# Altium schematic sheet GSM.SchDoc
size A; SheetNumber: 10; SheetTotal: 12
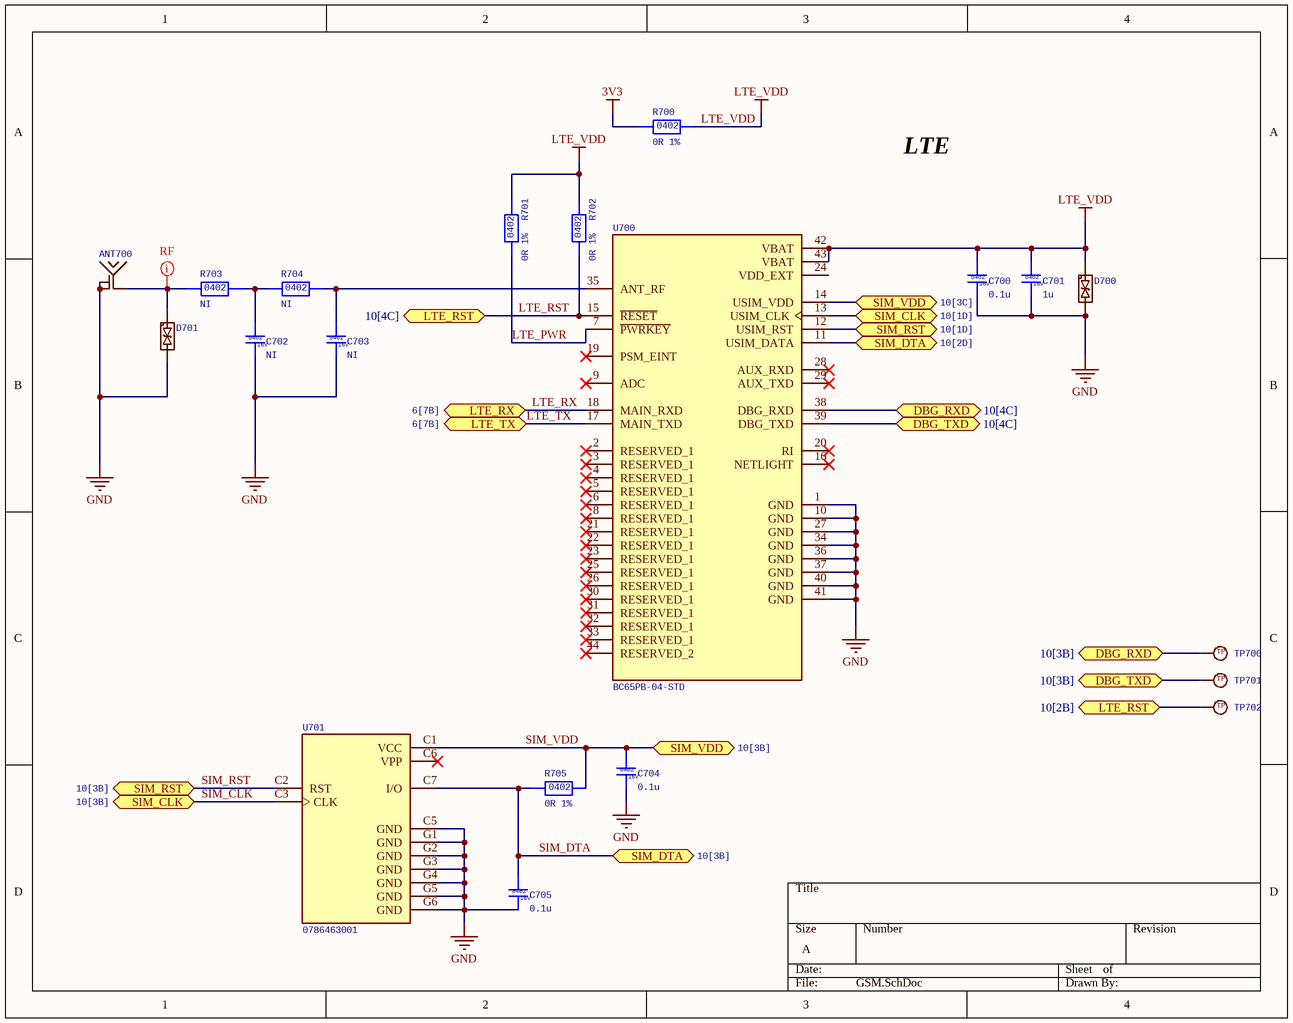
[diagram p0: GSM.SchDoc]

## Parts
ANT700  2337019-1  [2337019-1]  (value not drawn)
C700  0.1u  [CAP0402]
C701  1u  [CAP0402]
C702  NI  [CAP0402]
C703  NI  [CAP0402]
C704  0.1u  [CAP0402]
C705  0.1u  [CAP0402]
D700  DESD3V3S1BL-7B  [DESD3V3S1BL-7B]  (value not drawn)
D701  DESD3V3S1BL-7B  [DESD3V3S1BL-7B]  (value not drawn)
R700  0R 1%  [RES0402]
R701  0R 1%  [RES0402]
R702  0R 1%  [RES0402]
R703  NI  [RES0402]
R704  NI  [RES0402]
R705  0R 1%  [RES0402]
TP700  TP  [TP]  (value not drawn)
TP701  TP  [TP]  (value not drawn)
TP702  TP  [TP]  (value not drawn)
U700  BC65PB-04-STD  [BC65PB-04-STD]
U701  0786463001  [0786463001]

## Ports
DBG_RXD (bidir, see 10[3B]), DBG_RXD (bidir, see 10[4C]), DBG_TXD (bidir, see 10[3B]), DBG_TXD (bidir, see 10[4C]), LTE_RST (bidir, see 10[2B]), LTE_RST (bidir, see 10[4C]), LTE_RX (bidir, see 6[7B]), LTE_TX (bidir, see 6[7B]), SIM_CLK (bidir, see 10[1D]), SIM_CLK (bidir, see 10[3B]), SIM_DTA (bidir, see 10[2D]), SIM_DTA (bidir, see 10[3B]), SIM_RST (bidir, see 10[1D]), SIM_RST (bidir, see 10[3B]), SIM_VDD (bidir, see 10[3B]), SIM_VDD (bidir, see 10[3C])

## Nets
3V3: R700.1
GND: ANT700.G1(GND) ANT700.G2(GND) C700.2 C701.2 C702.2 C703.2 C704.2 C705.2 D700.2 D701.2 U700.1(GND) U700.10(GND) U700.27(GND) U700.34(GND) U700.36(GND) U700.37(GND) U700.40(GND) U700.41(GND) U701.C5(GND) U701.G1(GND) U701.G2(GND) U701.G3(GND) U701.G4(GND) U701.G5(GND) U701.G6(GND)
LTE_VDD: C700.1 C701.1 D700.1 R700.2 R701.2 R702.2 U700.42(VBAT) U700.43(VBAT)
DBG_RXD: TP700.1 U700.38(DBG_RXD) ; port DBG_RXD
DBG_TXD: TP701.1 U700.39(DBG_TXD) ; port DBG_TXD
LTE_PWR: R701.1 U700.7(~{PWRKEY})
LTE_RST: R702.1 TP702.1 U700.15(~{RESET}) ; port LTE_RST
LTE_RX: U700.18(MAIN_RXD) ; port LTE_RX
LTE_TX: U700.17(MAIN_TXD) ; port LTE_TX
SIM_CLK: U700.13(USIM_CLK) U701.C3(CLK) ; port SIM_CLK
SIM_DTA: C705.1 R705.1 U700.11(USIM_DATA) U701.C7(I/O) ; port SIM_DTA
SIM_RST: U700.12(USIM_RST) U701.C2(RST) ; port SIM_RST
SIM_VDD: C704.1 R705.2 U700.14(USIM_VDD) U701.C1(VCC) ; port SIM_VDD
NetANT700_1: ANT700.1 D701.1 R703.1
NetC702_1: C702.1 R703.2 R704.1
NetC703_1: C703.1 R704.2 U700.35(ANT_RF)

Not connected (* = marked no-connect by the designer): U700 2(RESERVED_1)* 3(RESERVED_1)* 4(RESERVED_1)* 5(RESERVED_1)* 6(RESERVED_1)* 8(RESERVED_1)* 9(ADC)* 16(NETLIGHT)* 19(PSM_EINT)* 20(RI)* 21(RESERVED_1)* 22(RESERVED_1)* 23(RESERVED_1)* 24(VDD_EXT) 25(RESERVED_1)* 26(RESERVED_1)* 28(AUX_RXD)* 29(AUX_TXD)* 30(RESERVED_1)* 31(RESERVED_1)* 32(RESERVED_1)* 33(RESERVED_1)* 44(RESERVED_2)*; U701 C6(VPP)*

## Layout directives
mark named RF: NetANT700_1

## Notes on the sheet
- LTE

## Library data of the parts
ANT700 = 2337019-1: UMCC MICRO-COAX RECEPTACLE, GEN; Supplier 1: Digikey; Supplier Part Number 1: A144746CT-ND
C700 C702-C705 = C_0402_0.1u: Ceramic Capacitor, Multilayer, Ceramic, 16V, 10% +Tol, 10% -Tol, X7R, 15% TC, 0.1uF, Surface Mount, 0402; Manufacturer: Murata; Manufacturer Part Number: GRM155R71C104KA88J; Value: 100nF; Multilayer: Yes; Supplier: Digikey; Supplier Part Number: 490-6328-1-ND; RoHS: Yes; Category: Ceramic Capacitors; Stock: 19409569; Pricing: 1=0.1, 10=0.019, 50=0.011, 100=0.0086, 500=0.00646, 1000=0.00508, 2500=0.00462, 5000=0.00425 (USD); Mounting Technology: Surface Mount; Pins: 2; Dielectric Material: Ceramic; Package Shape: Rectangular; Case/Package: 0402; Terminal Finish: Nickel; Min Operating Temperature: -55°C; Max Operating Temperature: 125°C; JESD-609 Code: e3; Capacitor Type: Ceramic; Tolerance  (fill in as +-): 10%; Package Style: SMTMeter; Packaging: Tape and Reel; Tolerance (fill in as +-): 10%; Rated DC Voltage (URdc): 16V; Temperature Characteristics Code: X7R; Termination: Wraparound; Length: 1mm; Width: 0.5mm; Height: 0.5mm; Reach SVHC Compliant: Yes; RoHS Compliant: Yes; ComponentLink1URL: https://psearch.en.murata.com:443/capacitor/product/GRM155R71C104KA88%23.pdf?src-supplier=IHS+Markit; ComponentLink1Description: https://psearch.en.murata.com:443/capacitor/product/GRM155R71C104KA88%23.pdf?src-supplier=IHS+Markit; ComponentLink2URL: https://datasheet.ciiva.com/6271/product-6271168.pdf?src-supplier=Digikey; ComponentLink2Description: https://datasheet.ciiva.com/6271/product-6271168.pdf?src-supplier=Digikey; ComponentLink3URL: https://datasheet.ciiva.com/6271/grm155r71c104ka88-01-6271231.pdf?src-supplier=Digikey; ComponentLink3Description: https://datasheet.ciiva.com/6271/grm155r71c104ka88-01-6271231.pdf?src-supplier=Digikey
C701 = C_0402_1u: Ceramic Capacitor, Multilayer, Ceramic, 16V, 10% +Tol, 10% -Tol, X5R, 15% TC, 1uF, Surface Mount, 0402; Manufacturer: Taiyo Yuden; Manufacturer Part Number: EMK105BJ105KV-F; Multilayer: Yes; Supplier: Digikey; Supplier Part Number: 587-2477-1-ND; RoHS: Yes; Category: Ceramic Capacitors; Stock: 2709915; Pricing: 1=0.1, 10=0.045, 50=0.031, 100=0.0266, 500=0.01912, 1000=0.01682, 2500=0.01437, 5000=0.01289 (USD); Mounting Technology: Surface Mount; Pins: 2; Dielectric Material: Ceramic; Package Shape: Rectangular; Case/Package: 0402; Terminal Finish: Nickel; Min Operating Temperature: -55°C; Max Operating Temperature: 85°C; JESD-609 Code: e3; Value: 1uF; Capacitor Type: Ceramic; Tolerance  (fill in as +-): 10%; Package Style: SMTMeter; Packaging: Tape and Reel; Tolerance (fill in as +-): 10%; Rated DC Voltage (URdc): 16V; Temperature Characteristics Code: X5R; Termination: Wraparound; Length: 1mm; Width: 0.5mm; Height: 0.5mm; Reach SVHC Compliant: Yes; RoHS Compliant: Yes; ComponentLink1URL: https://datasheet.ciiva.com:443/pdfs/VipMasterIC/IC/TAIY/TAIY-S-A0009096450/TAIY-S-A0009096597-1.pdf?src-supplier=IHS+Markit; ComponentLink1Description: https://datasheet.ciiva.com:443/pdfs/VipMasterIC/IC/TAIY/TAIY-S-A0009096450/TAIY-S-A0009096597-1.pdf?src-supplier=IHS+Markit; ComponentLink2URL: https://datasheet.ciiva.com/134/emk105bj105kv-f-ss-134209.pdf?src-supplier=Digikey; ComponentLink2Description: https://datasheet.ciiva.com/134/emk105bj105kv-f-ss-134209.pdf?src-supplier=Digikey; ComponentLink3URL: https://datasheet.ciiva.com/15920/964emk105bj105kv-f-15920402.pdf?src-supplier=Onlinecomponents.com; ComponentLink3Description: https://datasheet.ciiva.com/15920/964emk105bj105kv-f-15920402.pdf?src-supplier=Onlinecomponents.com; ComponentLink4URL: https://datasheet.ciiva.com/26871/getdatasheetpartid-638287-26871289.pdf?src-supplier=Verical; ComponentLink4Description: https://datasheet.ciiva.com/26871/getdatasheetpartid-638287-26871289.pdf?src-supplier=Verical; ComponentLink5URL: https://datasheet.ciiva.com/30259/265emk105bj105kv-f-30259872.pdf?src-supplier=Onlinecomponents.com; ComponentLink5Description: https://datasheet.ciiva.com/30259/265emk105bj105kv-f-30259872.pdf?src-supplier=Onlinecomponents.com; ComponentLink6URL: https://datasheet.ciiva.com/7657/1497285-7657320.pdf?src-supplier=Element14; ComponentLink6Description: https://datasheet.ciiva.com/7657/1497285-7657320.pdf?src-supplier=Element14; ComponentLink7URL: https://datasheet.ciiva.com/22694/1497285-22694239.pdf?src-supplier=Element14; ComponentLink7Description: https://datasheet.ciiva.com/22694/1497285-22694239.pdf?src-supplier=Element14; ComponentLink8URL: https://datasheet.ciiva.com/5424/mlcc01-e-5424190.pdf?src-supplier=Mouser; ComponentLink8Description: https://datasheet.ciiva.com/5424/mlcc01-e-5424190.pdf?src-supplier=Mouser
D700 D701 = DESD3V3S1BL-7B: Trans Voltage Suppressor Diode, 35W, 3.3V V(RWM), Bidirectional, 1 Element, Silicon; Manufacturer: Diodes; Package Body Material: Plastic; Max Breakdown Voltage: 6.5V; Min Breakdown Voltage: 3.8V; Number of Elements: 1; Max Power Dissipation: 250mW; Supplier 1: Digikey; Supplier Part Number 1: DESD3V3S1BL-7BDICT-ND; Supplier: Digikey; Supplier Part Number: DESD3V3S1BL-7BDICT-ND; Manufacturer Part Number: DESD3V3S1BL-7B; RoHS: Yes; Category: TVS Diodes; Stock: 1369752; Pricing: 1=0.22, 10=0.148, 100=0.0722, 500=0.0602, 1000=0.04182, 2000=0.03625, 5000=0.03362, 10000=0.0302, 20000=0.02888 (USD); Pins: 2; Diode Element Material: SILICON; Package Shape: Rectangular; Terminal Finish: Nickel; Min Operating Temperature: -65°C; Max Operating Temperature: 150°C; JESD-609 Code: e4; Polarity: Bidirectional; Diode Type: TRANS VOLTAGE SUPPRESSOR; Moisture Sensitivity Level: 1; Non-rep Peak Rev Power Dis-Max: 35W; Package Style: CHIP CARRIERMeter; Rep Pk Reverse Voltage-Max: 3.3V; Surface Mount: Yes; Technology: AVALANCHE; Terminal Form: No Lead; Terminal Position: BOTTOM; Reach SVHC Compliant: Yes; RoHS Compliant: Yes; ComponentLink1URL: https://datasheet.ciiva.com:443/pdfs/VipMasterIC/IC/DIOD/DIOD-S-A0005045876/DIOD-S-A0005045876-1.pdf?src-supplier=IHS+Markit; ComponentLink1Description: https://datasheet.ciiva.com:443/pdfs/VipMasterIC/IC/DIOD/DIOD-S-A0005045876/DIOD-S-A0005045876-1.pdf?src-supplier=IHS+Markit; ComponentLink2URL: https://datasheet.ciiva.com/48480/desd3v3s1bl-48480026.pdf?src-supplier=Avnet; ComponentLink2Description: https://datasheet.ciiva.com/48480/desd3v3s1bl-48480026.pdf?src-supplier=Avnet
R700-R702 R705 = R_0402_0R: Metal Glaze/thick Film, 0.0625W, 0ohm, Surface Mount, 0402; Manufacturer: Yageo; Manufacturer Part Number: RC0402JR-070RL; Power: 62.5mW; Rated Temperature: 70°C; Package Height: 0.35mm; Package Length: 1mm; Package Width: 0.5mm; Supplier 1: Digikey; Supplier Part Number 1: 311-0.0JRTR-ND; Supplier: Digikey; Supplier Part Number: 311-0.0JRCT-ND; RoHS: Yes; Category: Chip SMD Resistors; Stock: 14877447; Pricing: 1=0.1, 10=0.011, 25=0.0084, 50=0.0064, 100=0.0045, 250=0.00364, 500=0.0029, 1000=0.00214, 5000=0.00154, 10000=0.00133, 30000=0.00117, 50000=0.00107, 100000=0.00105 (USD); Mounting Technology: Surface Mount; Pins: 2; Package Shape: Rectangular; Case/Package: 0402; Terminal Finish: Nickel; Min Operating Temperature: -55°C; Max Operating Temperature: 155°C; JESD-609 Code: e3; Resistor Type: FIXED RESISTOR; Packaging: Tape and Reel; Value: 0R; Technology: METAL GLAZE/THICK FILM; Termination: Wraparound; Construction: Chip; Package Style: SMTMeter; Reach SVHC Compliant: Yes; RoHS Compliant: Yes; ComponentLink1URL: https://datasheet.ciiva.com:443/pdfs/VipMasterIC/IC/YAGO/YAGO-S-A0008145938/YAGO-S-A0008145938-1.pdf?src-supplier=IHS+Markit; ComponentLink1Description: https://datasheet.ciiva.com:443/pdfs/VipMasterIC/IC/YAGO/YAGO-S-A0008145938/YAGO-S-A0008145938-1.pdf?src-supplier=IHS+Markit; ComponentLink2URL: https://datasheet.ciiva.com/2452/pyu-rc0402-51-rohs-l-6-2452608.pdf?src-supplier=Digikey; ComponentLink2Description: https://datasheet.ciiva.com/2452/pyu-rc0402-51-rohs-l-6-2452608.pdf?src-supplier=Digikey; ComponentLink3URL: https://datasheet.ciiva.com/11808/0900766b80c66297-11808195.pdf?src-supplier=Rs; ComponentLink3Description: https://datasheet.ciiva.com/11808/0900766b80c66297-11808195.pdf?src-supplier=Rs; ComponentLink4URL: https://datasheet.ciiva.com/7983/1018594-7983535.pdf?src-supplier=Element14; ComponentLink4Description: https://datasheet.ciiva.com/7983/1018594-7983535.pdf?src-supplier=Element14; ComponentLink5URL: https://datasheet.ciiva.com/22747/1018594-22747515.pdf?src-supplier=Element14; ComponentLink5Description: https://datasheet.ciiva.com/22747/1018594-22747515.pdf?src-supplier=Element14; ComponentLink6URL: https://datasheet.ciiva.com/2452/pyu-r-int-thick-7-2452609.pdf?src-supplier=Digikey; ComponentLink6Description: https://datasheet.ciiva.com/2452/pyu-r-int-thick-7-2452609.pdf?src-supplier=Digikey; ComponentLink7URL: https://datasheet.ciiva.com/2452/pyu-r-int-thick-7-2452610.pdf?src-supplier=Digikey; ComponentLink7Description: https://datasheet.ciiva.com/2452/pyu-r-int-thick-7-2452610.pdf?src-supplier=Digikey; ComponentLink8URL: https://datasheet.ciiva.com/8896/pyu-rc0402-51-rohs-l-6-8896201.pdf?src-supplier=Avnet; ComponentLink8Description: https://datasheet.ciiva.com/8896/pyu-rc0402-51-rohs-l-6-8896201.pdf?src-supplier=Avnet
R703 R704 = R_0402_0R: Metal Glaze/thick Film, 0.0625W, 0ohm, Surface Mount, 0402; Manufacturer: Yageo; Manufacturer Part Number: RC0402JR-070RL; Power: 62.5mW; Rated Temperature: 70°C; Value: 0R; Package Height: 0.35mm; Package Length: 1mm; Package Width: 0.5mm; Supplier 1: Digikey; Supplier Part Number 1: 311-0.0JRTR-ND; Supplier: Digikey; Supplier Part Number: 311-0.0JRCT-ND; RoHS: Yes; Category: Chip SMD Resistors; Stock: 14877447; Pricing: 1=0.1, 10=0.011, 25=0.0084, 50=0.0064, 100=0.0045, 250=0.00364, 500=0.0029, 1000=0.00214, 5000=0.00154, 10000=0.00133, 30000=0.00117, 50000=0.00107, 100000=0.00105 (USD); Mounting Technology: Surface Mount; Pins: 2; Package Shape: Rectangular; Case/Package: 0402; Terminal Finish: Nickel; Min Operating Temperature: -55°C; Max Operating Temperature: 155°C; JESD-609 Code: e3; Resistor Type: FIXED RESISTOR; Packaging: Tape and Reel; Technology: METAL GLAZE/THICK FILM; Termination: Wraparound; Construction: Chip; Package Style: SMTMeter; Reach SVHC Compliant: Yes; RoHS Compliant: Yes; ComponentLink1URL: https://datasheet.ciiva.com:443/pdfs/VipMasterIC/IC/YAGO/YAGO-S-A0008145938/YAGO-S-A0008145938-1.pdf?src-supplier=IHS+Markit; ComponentLink1Description: https://datasheet.ciiva.com:443/pdfs/VipMasterIC/IC/YAGO/YAGO-S-A0008145938/YAGO-S-A0008145938-1.pdf?src-supplier=IHS+Markit; ComponentLink2URL: https://datasheet.ciiva.com/2452/pyu-rc0402-51-rohs-l-6-2452608.pdf?src-supplier=Digikey; ComponentLink2Description: https://datasheet.ciiva.com/2452/pyu-rc0402-51-rohs-l-6-2452608.pdf?src-supplier=Digikey; ComponentLink3URL: https://datasheet.ciiva.com/11808/0900766b80c66297-11808195.pdf?src-supplier=Rs; ComponentLink3Description: https://datasheet.ciiva.com/11808/0900766b80c66297-11808195.pdf?src-supplier=Rs; ComponentLink4URL: https://datasheet.ciiva.com/7983/1018594-7983535.pdf?src-supplier=Element14; ComponentLink4Description: https://datasheet.ciiva.com/7983/1018594-7983535.pdf?src-supplier=Element14; ComponentLink5URL: https://datasheet.ciiva.com/22747/1018594-22747515.pdf?src-supplier=Element14; ComponentLink5Description: https://datasheet.ciiva.com/22747/1018594-22747515.pdf?src-supplier=Element14; ComponentLink6URL: https://datasheet.ciiva.com/2452/pyu-r-int-thick-7-2452609.pdf?src-supplier=Digikey; ComponentLink6Description: https://datasheet.ciiva.com/2452/pyu-r-int-thick-7-2452609.pdf?src-supplier=Digikey; ComponentLink7URL: https://datasheet.ciiva.com/2452/pyu-r-int-thick-7-2452610.pdf?src-supplier=Digikey; ComponentLink7Description: https://datasheet.ciiva.com/2452/pyu-r-int-thick-7-2452610.pdf?src-supplier=Digikey; ComponentLink8URL: https://datasheet.ciiva.com/8896/pyu-rc0402-51-rohs-l-6-8896201.pdf?src-supplier=Avnet; ComponentLink8Description: https://datasheet.ciiva.com/8896/pyu-rc0402-51-rohs-l-6-8896201.pdf?src-supplier=Avnet
TP700-TP702 = TP: Test Point
U700 = BC65PB-04-STD: Compact NB-IoT Module with Ultra-low Power Consumption for Quectel GSM/GPRS M66/NB-IoT BC66/BC66-NA/BC68 LCC; Manufacturer: Quectel Wireless Solutions; Supplier: Digikey; Supplier Part Number: 2958-BC65PB-04-STDCT-ND; Manufacturer Part Number: BC65PB-04-STD; RoHS: No; Stock: 1260; Pricing: 1=8.4, 10=7.7, 25=7, 100=6.3 (USD); ComponentLink1URL: https://datasheet.octopart.com/BC65PB-04-STD-Quectel-datasheet-163886004.pdf?src-supplier=SOS+electronic; ComponentLink1Description: https://datasheet.octopart.com/BC65PB-04-STD-Quectel-datasheet-163886004.pdf?src-supplier=SOS+electronic; Supplier 1: Digikey; Supplier Part Number 1: 2958-BC65PB-04-STDCT-ND
U701 = 0786463001: PCB Connector; Manufacturer: Molex; Manufacturer Series: 78646; Supplier: Digikey; Supplier Part Number: WM9364CT-ND; Manufacturer Part Number: 0786463001; RoHS: Yes; Stock: 215355; Pricing: 1=0.89, 10=0.737, 100=0.6142 (USD); Contact Finish - Mating: NOT SPECIFIED; Connector Type: PCB; Reach SVHC Compliant: Yes; RoHS Compliant: Yes; ComponentLink1URL: https://datasheet.ciiva.com:443/pdfs/VipMasterIC/IC/MOLE/MOLE-S-A0006767587/MOLE-S-A0006867848-1.pdf?src-supplier=IHS+Markit; ComponentLink1Description: https://datasheet.ciiva.com:443/pdfs/VipMasterIC/IC/MOLE/MOLE-S-A0006767587/MOLE-S-A0006867848-1.pdf?src-supplier=IHS+Markit; Supplier 1: Digikey; Supplier Part Number 1: WM9364CT-ND